# Altium project cwtrigger_usb.PrjPcb (part 2 of 2)
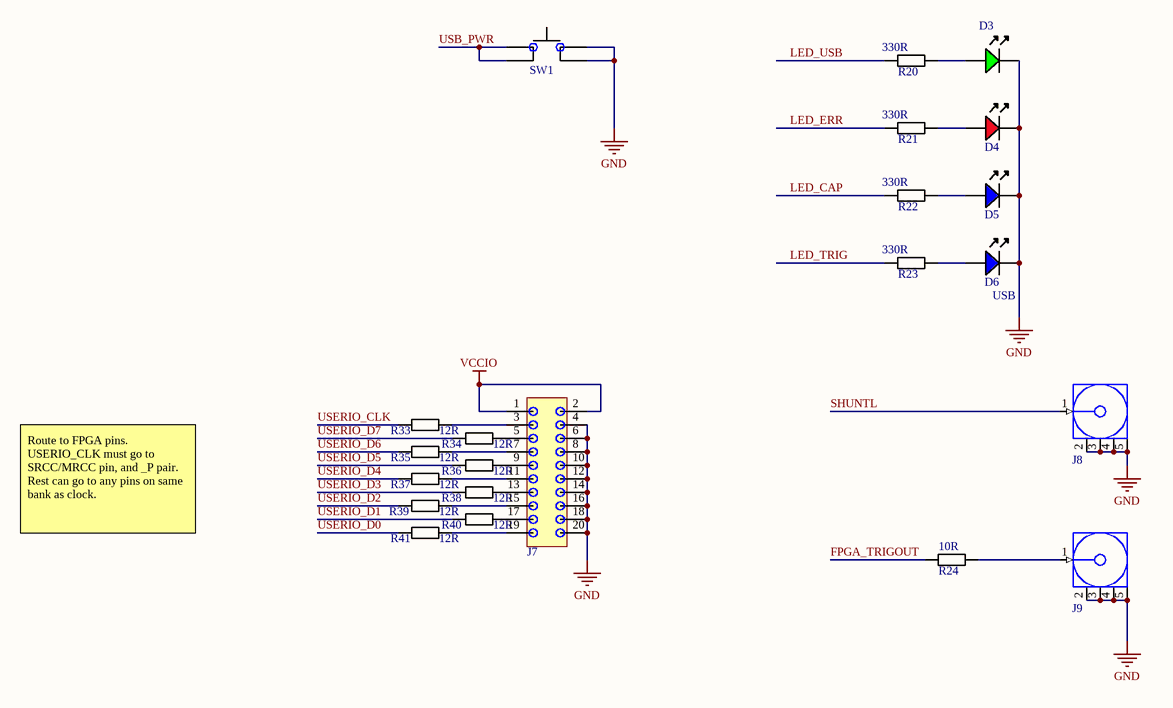
[diagram p8: ct_userio.SchDoc]

## Nets that join several sheets
GND: ct_back (11 pins), ct_fpga_pwr (68 pins), ct_psu (26 pins), ct_micro (34 pins), fpga_misc (J10.3 J10.5 J10.9), ct_frontend (41 pins), ct_userio (23 pins)
VCC1V8: ct_fpga_pwr (7 pins), ct_psu (C70.1 C71.1 U10.2 U10.4)
VCCINT: ct_fpga_pwr (21 pins), ct_psu (C63.1 C64.1 L3.2 R27.1)
VCCIO: ct_fpga_io (R32.1), ct_fpga_pwr (15 pins), ct_psu (8 pins), fpga_misc (7 pins), ct_frontend (12 pins), ct_userio (J7.1 J7.2)
VCCSAM: ct_psu (6 pins), ct_micro (26 pins)
F_USB0: ct_fpga_io (U2.B14), ct_frontend (U3.2)
F_USB1: ct_fpga_io (U2.F14), ct_frontend (U3.15)
F_USB2: ct_fpga_io (U2.C14), ct_frontend (U3.3)
F_USB3: ct_fpga_io (U2.D13), ct_frontend (U3.4)
F_USB4: ct_fpga_io (U2.D14), ct_frontend (U3.7)
F_USB5: ct_fpga_io (U2.E13), ct_frontend (U3.8)
F_USB6: ct_fpga_io (U2.F13), ct_frontend (U3.9)
F_USB7: ct_fpga_io (U2.G14), ct_frontend (U3.16)
F_USB8: ct_fpga_io (U2.H14), ct_frontend (U3.17)
F_USB9: ct_fpga_io (U2.J14), ct_frontend (U3.19)
F_USB10: ct_fpga_io (U2.J13), ct_frontend (U3.18)
F_USB11: ct_fpga_io (U2.L13), ct_frontend (U3.20)
F_USB12: ct_fpga_io (U2.L14), ct_frontend (U3.21)
F_USB13: ct_fpga_io (U2.N14), ct_frontend (U3.26)
F_USB14: ct_fpga_io (U2.M14), ct_frontend (U3.25)
F_USB15: ct_fpga_io (U2.J12), ct_frontend (U3.30)
F_USB16: ct_fpga_io (U2.K12), ct_frontend (U3.31)
F_USB17: ct_fpga_io (U2.K11), ct_frontend (U3.32)
F_USB19: ct_fpga_io (U2.M11), ct_frontend (U3.41)
F_USB20: ct_fpga_io (U2.L12), ct_frontend (U3.29)
F_USB21: ct_fpga_io (U2.A10), ct_frontend (U3.38)
F_USB22: ct_fpga_io (R32.2 U2.B10), ct_frontend (U3.36)
F_USB23: ct_fpga_io (U2.C10), ct_frontend (U3.39)
F_USB24: ct_fpga_io (U2.D10), ct_frontend (U3.37)
F_USB25: ct_fpga_io (U2.C11), ct_frontend (U3.35)
F_USB26: ct_fpga_io (U2.E11), ct_frontend (U3.34)
F_USB27: ct_fpga_io (U2.F11), ct_frontend (U3.33)
F_USB28: ct_fpga_io (U2.B11), ct_frontend (U3.42)
F_USB29: ct_fpga_io (U2.A12), ct_frontend (U3.43)
F_USB30: ct_fpga_io (U2.C12), ct_frontend (U3.44)
F_USB31: ct_fpga_io (U2.A13), ct_frontend (U3.45)
F_USB32: ct_fpga_io (U2.B13), ct_frontend (U3.47)
F_USBFE_CLK: ct_fpga_io (U2.H13), ct_frontend (U3.23)
F_VBDC: ct_fpga_io (U2.K4), ct_frontend (Q3.1 R29.2)
F_VBHOST: ct_micro (U7.25), ct_frontend (Q1.1 U5.4)
F_VBSNIFF: ct_micro (U7.24), ct_frontend (Q2.1 U4.4)
FPGA_CCLK: ct_micro (U7.14), fpga_misc (U2.A8)
FPGA_CDOUT: ct_fpga_io (U2.B12), ct_micro (U7.17)
FPGA_CWIO0: ct_back (R52.1), ct_fpga_io (U2.M3)
FPGA_CWIO1: ct_back (R48.1), ct_fpga_io (U2.M2)
FPGA_CWIO2: ct_back (R49.2), ct_fpga_io (U2.L3)
FPGA_CWIO3: ct_back (R45.1), ct_fpga_io (U2.F3)
FPGA_CWIO4: ct_back (R47.2), ct_fpga_io (U2.F1)
FPGA_CWIO5: ct_back (R44.2), ct_fpga_io (U2.C1)
FPGA_CWIO6: ct_back (R53.2), ct_fpga_io (U2.P2)
FPGA_CWIO7: ct_back (R51.2), ct_fpga_io (U2.N1)
FPGA_CWIO8: ct_back (R50.1), ct_fpga_io (U2.M1)
FPGA_CWIO9: ct_back (R46.1), ct_fpga_io (U2.F2)
FPGA_CWIO10: ct_back (R43.1), ct_fpga_io (U2.E2)
FPGA_CWIO11: ct_back (R42.2), ct_fpga_io (U2.B1)
FPGA_DONE: ct_micro (U7.18), fpga_misc (U2.P9)
FPGA_INITB: ct_micro (U7.20), fpga_misc (R30.2 U2.P8)
FPGA_PGMB: ct_micro (U7.19), fpga_misc (R31.2 U2.L7)
FPGA_TRIGOUT: ct_fpga_io (U2.M13), ct_userio (R24.1)
LED_CAP: ct_fpga_io (U2.A2), ct_userio (R22.1)
LED_ERR: ct_micro (U7.86), ct_userio (R21.1)
LED_TRIG: ct_fpga_io (U2.D2), ct_userio (R23.1)
LED_USB: ct_micro (U7.85), ct_userio (R20.1)
PWR_ON: ct_psu (U8.7 U9.7), ct_micro (U7.67)
SHUNTL: ct_frontend (8 pins), ct_userio (J8.1)
USB_5V: ct_back (6 pins), ct_psu (12 pins), ct_frontend (PTC2.1)
USB_A0: ct_fpga_io (U2.L1), ct_micro (U7.99)
USB_A1: ct_fpga_io (U2.L2), ct_micro (U7.100)
USB_A2: ct_fpga_io (U2.G1), ct_micro (U7.90)
USB_A3: ct_fpga_io (U2.H1), ct_micro (U7.91)
USB_A4: ct_fpga_io (U2.H2), ct_micro (U7.92)
USB_A5: ct_fpga_io (U2.P3), ct_micro (U7.7)
USB_A6: ct_fpga_io (U2.P4), ct_micro (U7.8)
USB_A7: ct_fpga_io (U2.J3), ct_micro (U7.97)
USB_CLK: ct_fpga_io (U2.D1), ct_micro (U7.58)
USB_D0: ct_fpga_io (U2.B6), ct_micro (U7.71)
USB_D1: ct_fpga_io (U2.A5), ct_micro (U7.70)
USB_D2: ct_fpga_io (U2.H3), ct_micro (U7.93)
USB_D3: ct_fpga_io (U2.J1), ct_micro (U7.94)
USB_D4: ct_fpga_io (U2.J2), ct_micro (U7.95)
USB_D5: ct_fpga_io (U2.B5), ct_micro (U7.69)
USB_D6: ct_fpga_io (U2.P5), ct_micro (U7.16)
USB_D7: ct_fpga_io (U2.N4), ct_micro (U7.15)
USB_NCS: ct_fpga_io (U2.A3), ct_micro (U7.65)
USB_NRD: ct_fpga_io (U2.B3), ct_micro (U7.66)
USB_NWE: ct_fpga_io (U2.B2), ct_micro (U7.62)
USB_PWR: ct_micro (U7.23), ct_userio (SW1.1 SW1.4)
USB_SPARE0: ct_fpga_io (U2.K3), ct_micro (U7.98)
USB_SPARE1: ct_fpga_io (U2.A4), ct_micro (U7.68)
USBD_N: ct_back (J1.2 U1.3), ct_micro (R18.1 U7.77)
USBD_P: ct_back (J1.3 U1.2), ct_micro (R17.1 U7.76)
USERIO_CLK: ct_fpga_io (U2.G11), ct_userio (R33.1)
USERIO_D0: ct_fpga_io (U2.P13), ct_userio (R41.1)
USERIO_D1: ct_fpga_io (U2.M12), ct_userio (R40.1)
USERIO_D2: ct_fpga_io (U2.P12), ct_userio (R39.1)
USERIO_D3: ct_fpga_io (U2.N11), ct_userio (R38.1)
USERIO_D4: ct_fpga_io (U2.P11), ct_userio (R37.1)
USERIO_D5: ct_fpga_io (U2.N10), ct_userio (R36.1)
USERIO_D6: ct_fpga_io (U2.P10), ct_userio (R35.1)
USERIO_D7: ct_fpga_io (U2.M10), ct_userio (R34.1)